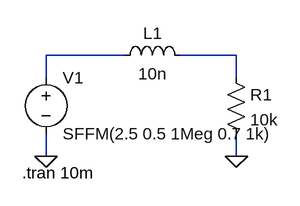
[diagram p0: schematic Draft1.asc]
Draft1.asc, the LTspice schematic file:
Version 4
SHEET 1 880 680
WIRE 160 176 48 176
WIRE 320 176 240 176
WIRE 48 208 48 176
WIRE 320 208 320 176
WIRE 48 320 48 288
WIRE 320 320 320 288
FLAG 48 320 0
FLAG 320 320 0
SYMBOL ind 144 192 R270
WINDOW 0 32 56 VTop 2
WINDOW 3 5 56 VBottom 2
SYMATTR InstName L1
SYMATTR Value 10n
SYMBOL voltage 48 192 R0
WINDOW 123 0 0 Left 0
WINDOW 39 0 0 Left 0
SYMATTR InstName V1
SYMATTR Value SFFM(2.5 0.5 1Meg 0.7 1k)
SYMBOL res 304 192 R0
SYMATTR InstName R1
SYMATTR Value 10k
TEXT 14 344 Left 2 !.tran 10m

The netlist it stands for:
* Draft1.asc
L1 N001 N002 10n
V1 N001 0 SFFM(2.5 0.5 1Meg 0.7 1k)
R1 N002 0 10k
.tran 10m
.backanno
.end